# Altium schematic sheet RotatingDUTtarget.SchDoc
size Letter
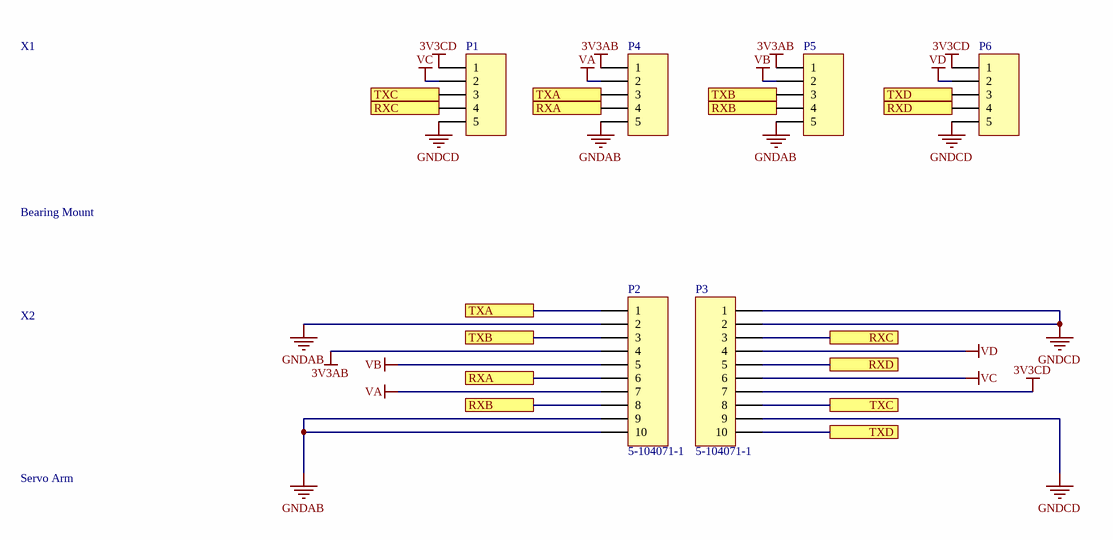
[diagram p0: RotatingDUTtarget.SchDoc]

## Parts
P1  811-22-005-30-000101  [811-22-005-30-000101]  (value not drawn)
P2  5-104071-1  [TEC-5-104071-1]
P3  5-104071-1  [TEC-5-104071-1]
P4  811-22-005-30-000101  [811-22-005-30-000101]  (value not drawn)
P5  811-22-005-30-000101  [811-22-005-30-000101]  (value not drawn)
P6  811-22-005-30-000101  [811-22-005-30-000101]  (value not drawn)
X1  Bearing Mount  [Bearing Mount]
X2  Servo Arm  [Servo Arm]

## Ports
RXA, RXB, RXC, RXD, TXA, TXB, TXC, TXD

## Nets
3V3AB: P2.4 P4.1 P5.1
3V3CD: P1.1 P3.7 P6.1
GNDAB: P2.2 P2.9 P2.10 P4.5 P5.5
GNDCD: P1.5 P3.1 P3.2 P3.9 P6.5
VA: P2.7 P4.2
VB: P2.5 P5.2
VC: P1.2 P3.6
VD: P3.4 P6.2
RXA: P2.6 P4.4 ; port RXA
RXB: P2.8 P5.4 ; port RXB
RXC: P1.4 P3.3 ; port RXC
RXD: P3.5 P6.4 ; port RXD
TXA: P2.1 P4.3 ; port TXA
TXB: P2.3 P5.3 ; port TXB
TXC: P1.3 P3.8 ; port TXC
TXD: P3.10 P6.3 ; port TXD

## Notes on the sheet
- (the "License"); you may not use or redistribute this file except in compliance with the License. You
- This file and the information within it are licensed under the terms of the Apache License, Version 2.0
- Copyright
- Unless required by applicable law or agreed to in writing, content distributed under the License is
- distributed on an "AS IS" BASIS, WITHOUT WARRANTIES OR CONDITIONS OF ANY KIND,
- either express or implied. See the License for the specific language governing permissions and
- limitations under the License.
- may obtain a copy of the License at:
- http://www.apache.org/licenses/LICENSE-2.0
- Title
- Size:
- Date:
- Letter
- Number:
- Time:
- Revision:
- Sheet
- of
- University of Alberta
- Deptartment of Electrical
- and Computer Engineering
- Edmonton AB, Canada
- T6G 1H9
- File:

## Library data of the parts
P1 P4-P6 = PP-MMM-00001: CONN SPRING CONT 05 POS .137 SMD; Index: 1; Designator: P?; LatestRevisionDate: 2018-05-10; LatestRevisionNote: ...; Publisher: AlbertaSat; Part Number: PP-MMM-00001; Manufacturer Part Number: 811-22-005-30-000101; Supplier Part Number 1: ED8110-05-ND; Supplier 1: Digi-key; Supplier Part Number 2: 575-8112200530000101; Supplier 2: Mouser; Published: 2018-05-10; Supplier Link: #https://www.digikey.ca/product-detail/en/mill-max-manufacturing-corp/811-22-005-30-000101/ED8110-05-ND/682273#
P2 P3 = 458: CONN HEADER 10POS .050 VERT GOLD; Part Number: 458; Designator: P?; LatestRevisionDate: 17-Jul-2002; LatestRevisionNote: Re-released for DXP Platform.; Publisher: Altium Limited; Manufacturer Part Number: 5-104071-1; Supplier Part Number 1: 5-104071-1-ND; Supplier 1: Digi-Key; Supplier Link: http://www.digikey.ca/product-search/en?keywords=5-104071-1-ND